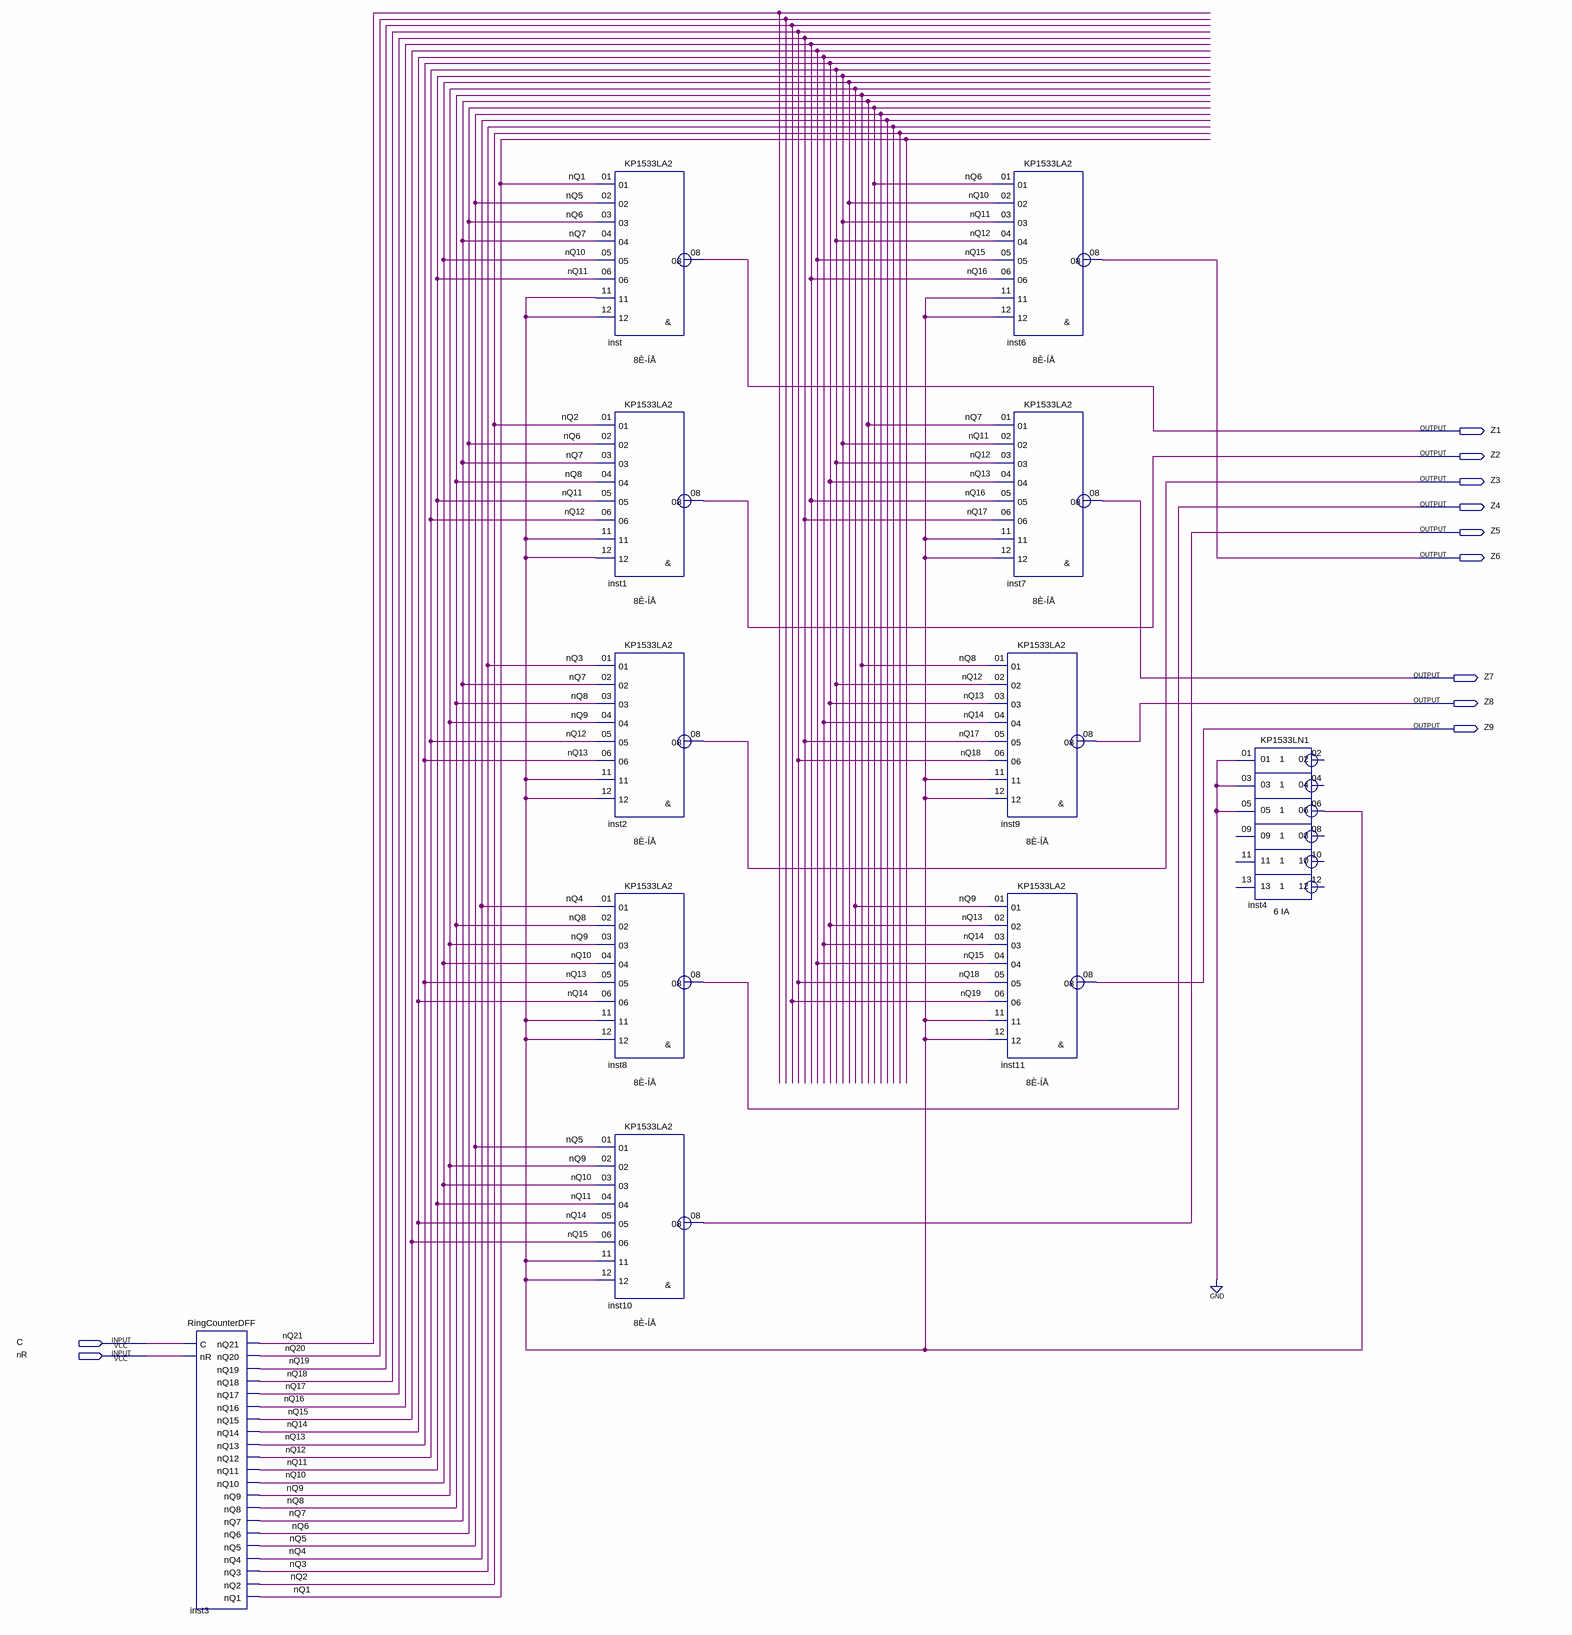
[diagram p0: schematic sheet]
// Quartus schematic PK_NAND.bdf as structural Verilog: 11 symbols, 11 pins
module PK_NAND (
  input  C,
  input  nR,
  output Z1,
  output Z2,
  output Z3,
  output Z4,
  output Z5,
  output Z6,
  output Z7,
  output Z8,
  output Z9
);

  wire inst4_06, nQ1, nQ2, nQ3, nQ4, nQ5, nQ6, nQ7, nQ8, nQ9, nQ10, nQ11, nQ12, nQ13, nQ14, nQ15, nQ16, nQ17,
       nQ18, nQ19, nQ20, nQ21;

  RingCounterDFF inst3 (
    .C(C), .nR(nR), .nQ21(nQ21), .nQ20(nQ20), .nQ19(nQ19), .nQ18(nQ18), .nQ17(nQ17), .nQ16(nQ16),
    .nQ15(nQ15), .nQ14(nQ14), .nQ13(nQ13), .nQ12(nQ12), .nQ11(nQ11), .nQ10(nQ10), .nQ9(nQ9), .nQ8(nQ8),
    .nQ7(nQ7), .nQ6(nQ6), .nQ5(nQ5), .nQ4(nQ4), .nQ3(nQ3), .nQ2(nQ2), .nQ1(nQ1));
  KP1533LA2 inst (
    .\01 (nQ1), .\02 (nQ5), .\03 (nQ6), .\04 (nQ7), .\05 (nQ10), .\06 (nQ11), .\11 (inst4_06),
    .\12 (inst4_06), .\08 (Z1));
  KP1533LA2 inst1 (
    .\01 (nQ2), .\02 (nQ6), .\03 (nQ7), .\04 (nQ8), .\05 (nQ11), .\06 (nQ12), .\11 (inst4_06),
    .\12 (inst4_06), .\08 (Z2));
  KP1533LA2 inst2 (
    .\01 (nQ3), .\02 (nQ7), .\03 (nQ8), .\04 (nQ9), .\05 (nQ12), .\06 (nQ13), .\11 (inst4_06),
    .\12 (inst4_06), .\08 (Z3));
  KP1533LA2 inst8 (
    .\01 (nQ4), .\02 (nQ8), .\03 (nQ9), .\04 (nQ10), .\05 (nQ13), .\06 (nQ14), .\11 (inst4_06),
    .\12 (inst4_06), .\08 (Z4));
  KP1533LA2 inst10 (
    .\01 (nQ5), .\02 (nQ9), .\03 (nQ10), .\04 (nQ11), .\05 (nQ14), .\06 (nQ15), .\11 (inst4_06),
    .\12 (inst4_06), .\08 (Z5));
  KP1533LA2 inst6 (
    .\01 (nQ6), .\02 (nQ10), .\03 (nQ11), .\04 (nQ12), .\05 (nQ15), .\06 (nQ16), .\11 (inst4_06),
    .\12 (inst4_06), .\08 (Z6));
  KP1533LA2 inst7 (
    .\01 (nQ7), .\02 (nQ11), .\03 (nQ12), .\04 (nQ13), .\05 (nQ16), .\06 (nQ17), .\11 (inst4_06),
    .\12 (inst4_06), .\08 (Z7));
  KP1533LA2 inst9 (
    .\01 (nQ8), .\02 (nQ12), .\03 (nQ13), .\04 (nQ14), .\05 (nQ17), .\06 (nQ18), .\11 (inst4_06),
    .\12 (inst4_06), .\08 (Z8));
  KP1533LA2 inst11 (
    .\01 (nQ9), .\02 (nQ13), .\03 (nQ14), .\04 (nQ15), .\05 (nQ18), .\06 (nQ19), .\11 (inst4_06),
    .\12 (inst4_06), .\08 (Z9));
  KP1533LN1 inst4 (.\01 (1'b0), .\03 (1'b0), .\05 (1'b0), .\06 (inst4_06));  // open: 09, 11, 13, 02, 04, 08, 10, 12
endmodule
